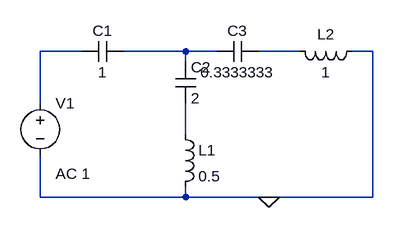
[diagram p0: schematic TS12_1.asc]
TS12_1.asc, the LTspice schematic file:
Version 4
SHEET 1 880 680
WIRE 16 112 -48 112
WIRE 176 112 80 112
WIRE 224 112 176 112
WIRE 352 112 288 112
WIRE 464 112 432 112
WIRE 176 128 176 112
WIRE -48 192 -48 112
WIRE 176 240 176 192
WIRE -48 336 -48 272
WIRE 176 336 176 320
WIRE 176 336 -48 336
WIRE 304 336 176 336
WIRE 464 336 464 112
WIRE 464 336 304 336
FLAG 304 336 0
SYMBOL cap 80 96 R90
WINDOW 0 0 32 VBottom 2
WINDOW 3 32 32 VTop 2
SYMATTR InstName C1
SYMATTR Value 1
SYMBOL cap 160 128 R0
SYMATTR InstName C2
SYMATTR Value 2
SYMBOL ind 160 224 R0
SYMATTR InstName L1
SYMATTR Value 0.5
SYMBOL cap 288 96 R90
WINDOW 0 0 32 VBottom 2
WINDOW 3 32 32 VTop 2
SYMATTR InstName C3
SYMATTR Value 0.3333333
SYMBOL ind 448 96 R90
WINDOW 0 5 56 VBottom 2
WINDOW 3 32 56 VTop 2
SYMATTR InstName L2
SYMATTR Value 1
SYMBOL voltage -48 176 R0
WINDOW 123 24 124 Left 2
WINDOW 39 0 0 Left 0
SYMATTR InstName V1
SYMATTR Value ""
SYMATTR Value2 AC 1

The netlist it stands for:
* TS12_1.asc
C1 N002 N001 1
C2 N002 N004 2
L1 N004 0 0.5
C3 N003 N002 0.3333333
L2 0 N003 1
V1 N001 0 AC 1
.backanno
.end